# Altium schematic sheet 16路放大模块.SchDoc
size A2 portrait
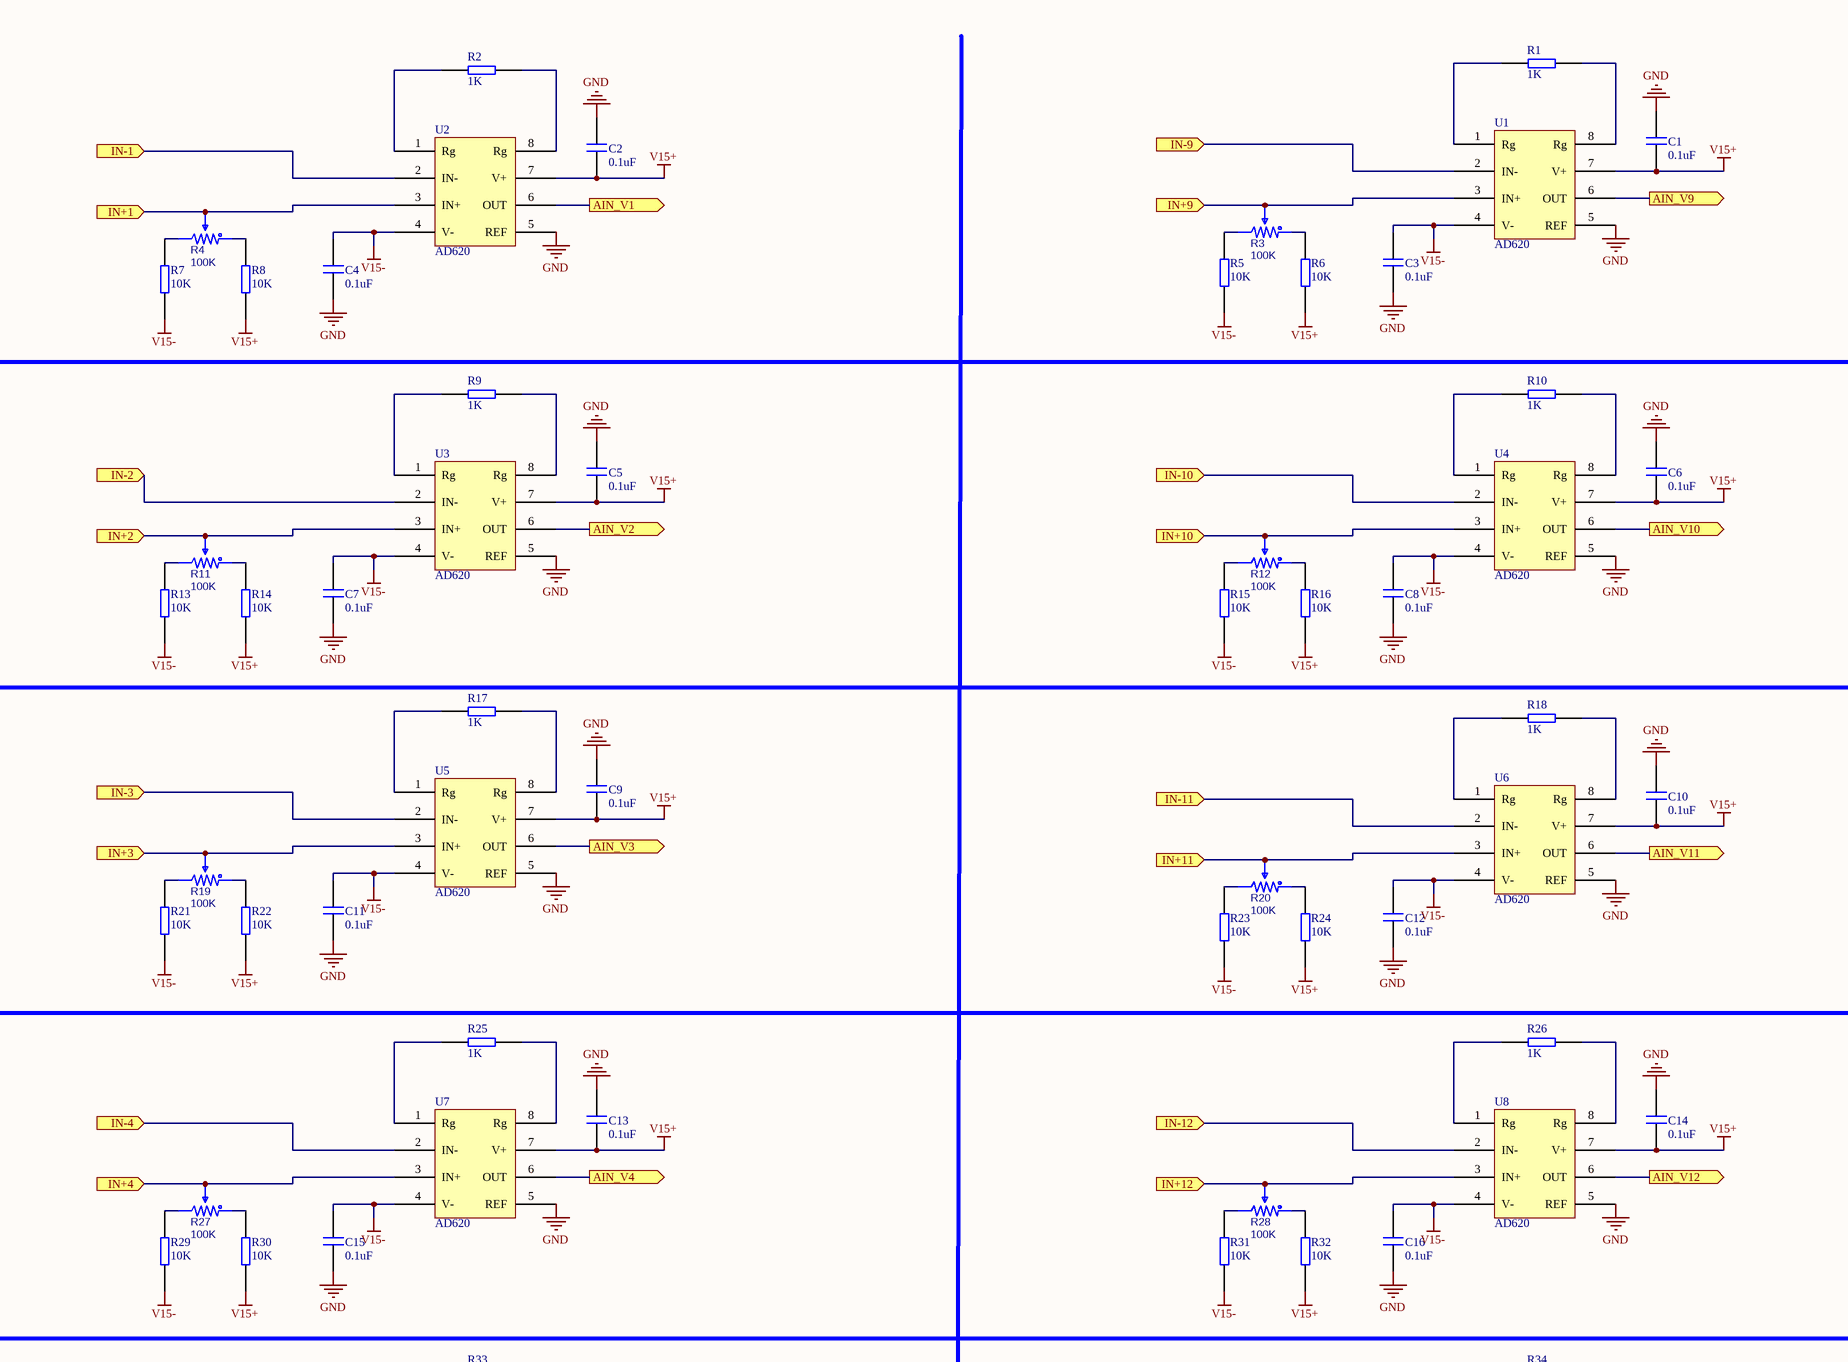
[diagram p0: 16路放大模块.SchDoc, top]
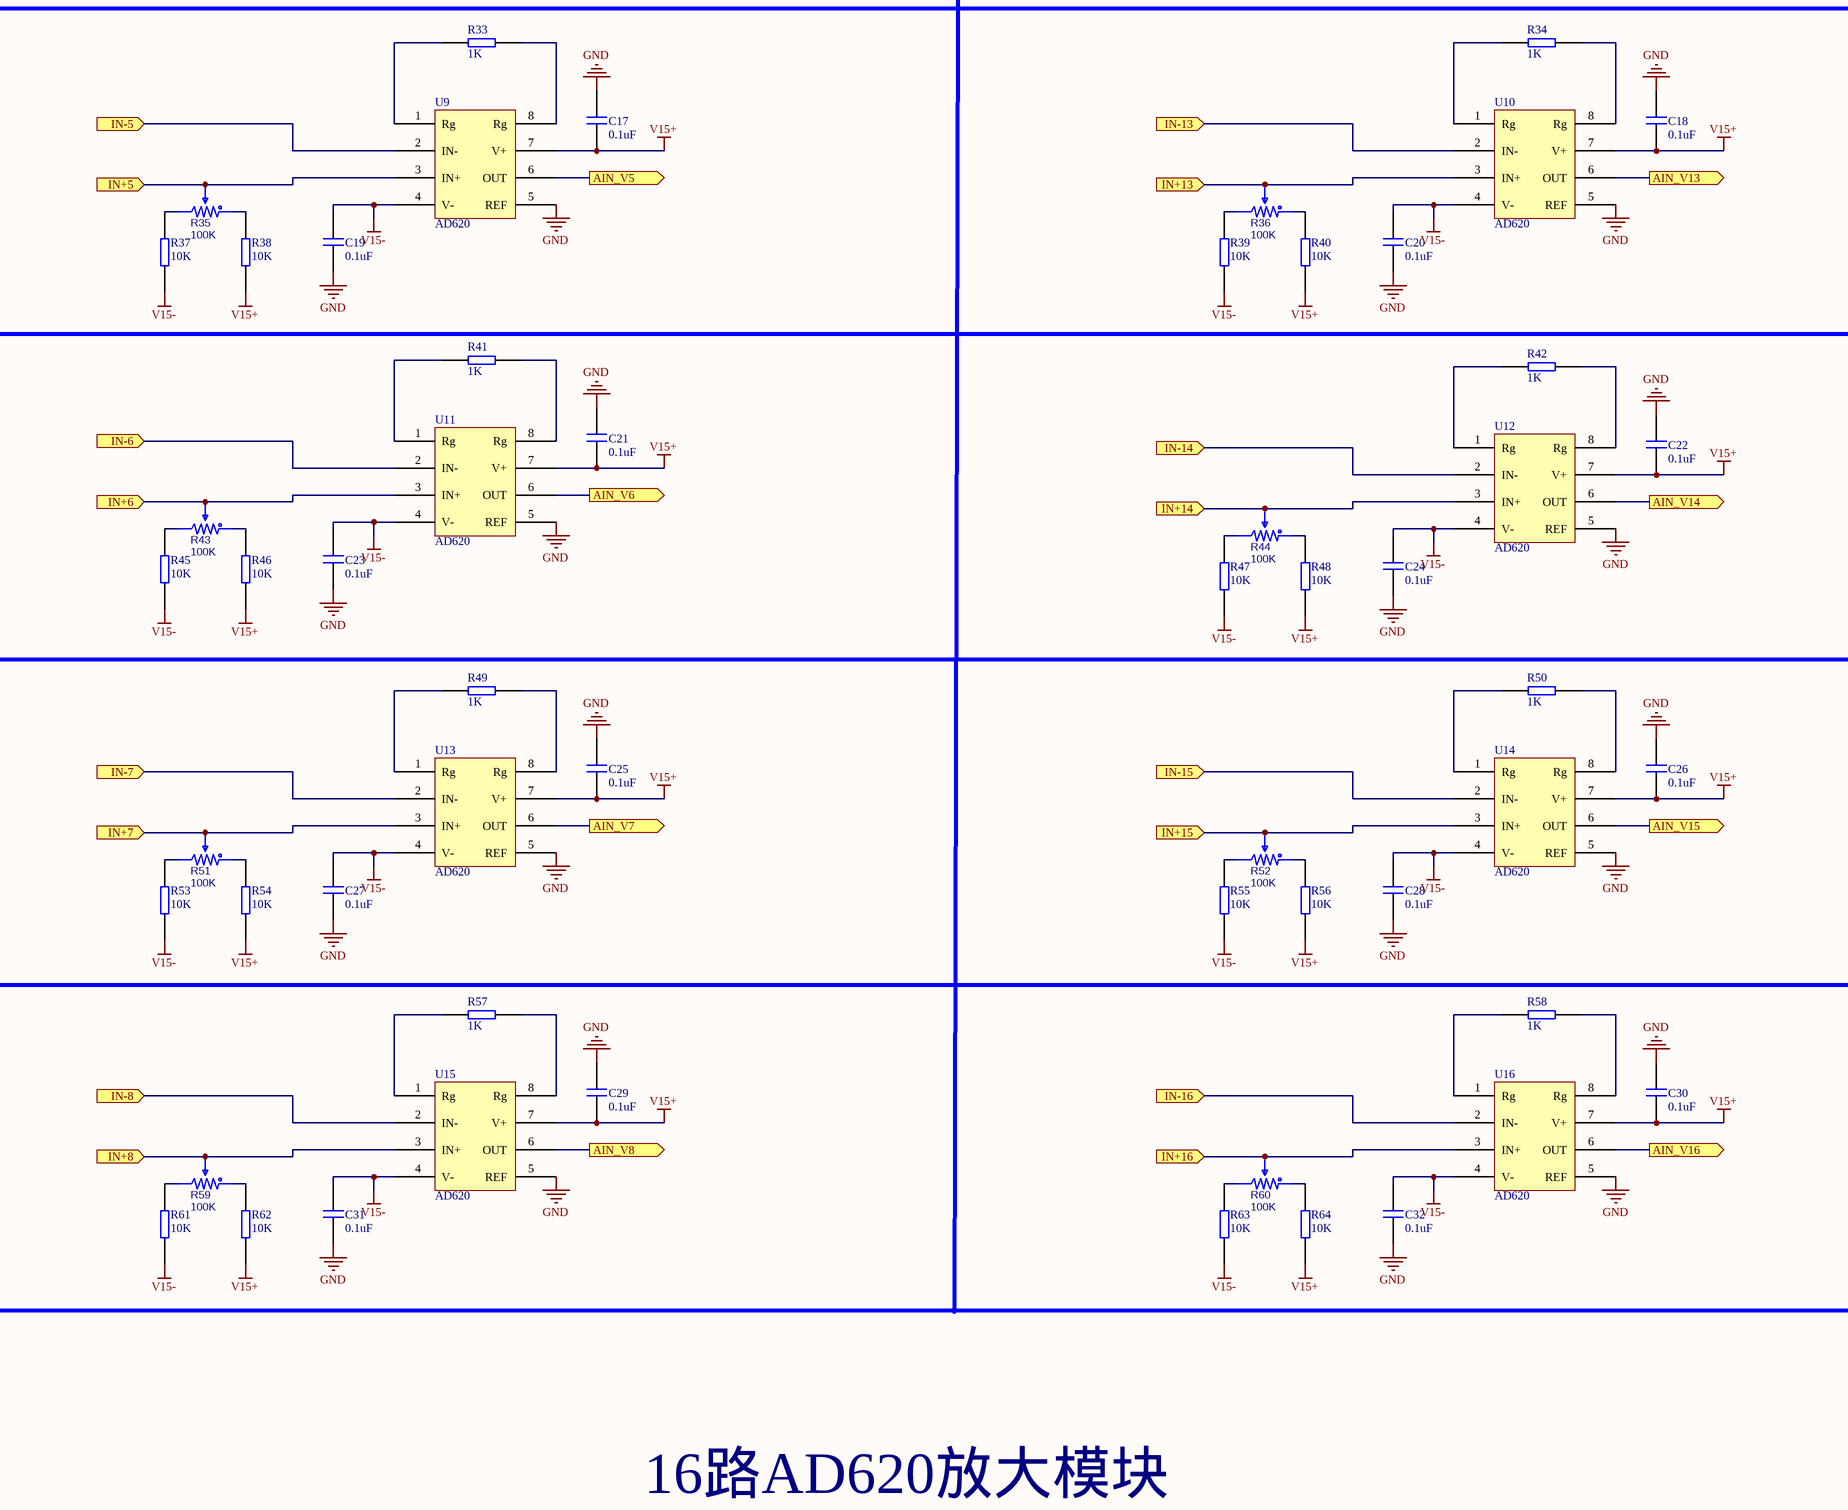
[diagram p1: 16路放大模块.SchDoc, bottom]

## Parts
C1  0.1uF  [0805C]
C2  0.1uF  [0805C]
C3  0.1uF  [0805C]
C4  0.1uF  [0805C]
C5  0.1uF  [0805C]
C6  0.1uF  [0805C]
C7  0.1uF  [0805C]
C8  0.1uF  [0805C]
C9  0.1uF  [0805C]
C10  0.1uF  [0805C]
C11  0.1uF  [0805C]
C12  0.1uF  [0805C]
C13  0.1uF  [0805C]
C14  0.1uF  [0805C]
C15  0.1uF  [0805C]
C16  0.1uF  [0805C]
C17  0.1uF  [0805C]
C18  0.1uF  [0805C]
C19  0.1uF  [0805C]
C20  0.1uF  [0805C]
C21  0.1uF  [0805C]
C22  0.1uF  [0805C]
C23  0.1uF  [0805C]
C24  0.1uF  [0805C]
C25  0.1uF  [0805C]
C26  0.1uF  [0805C]
C27  0.1uF  [0805C]
C28  0.1uF  [0805C]
C29  0.1uF  [0805C]
C30  0.1uF  [0805C]
C31  0.1uF  [0805C]
C32  0.1uF  [0805C]
R1  1K  [0805R]
R2  1K  [0805R]
R3  100K  [RES-ADJ-SMD_G43BT]
R4  100K  [RES-ADJ-SMD_G43BT]
R5  10K  [0603R]
R6  10K  [0603R]
R7  10K  [0603R]
R8  10K  [0603R]
R9  1K  [0805R]
R10  1K  [0805R]
R11  100K  [RES-ADJ-SMD_G43BT]
R12  100K  [RES-ADJ-SMD_G43BT]
R13  10K  [0603R]
R14  10K  [0603R]
R15  10K  [0603R]
R16  10K  [0603R]
R17  1K  [0805R]
R18  1K  [0805R]
R19  100K  [RES-ADJ-SMD_G43BT]
R20  100K  [RES-ADJ-SMD_G43BT]
R21  10K  [0603R]
R22  10K  [0603R]
R23  10K  [0603R]
R24  10K  [0603R]
R25  1K  [0805R]
R26  1K  [0805R]
R27  100K  [RES-ADJ-SMD_G43BT]
R28  100K  [RES-ADJ-SMD_G43BT]
R29  10K  [0603R]
R30  10K  [0603R]
R31  10K  [0603R]
R32  10K  [0603R]
R33  1K  [0805R]
R34  1K  [0805R]
R35  100K  [RES-ADJ-SMD_G43BT]
R36  100K  [RES-ADJ-SMD_G43BT]
R37  10K  [0603R]
R38  10K  [0603R]
R39  10K  [0603R]
R40  10K  [0603R]
R41  1K  [0805R]
R42  1K  [0805R]
R43  100K  [RES-ADJ-SMD_G43BT]
R44  100K  [RES-ADJ-SMD_G43BT]
R45  10K  [0603R]
R46  10K  [0603R]
R47  10K  [0603R]
R48  10K  [0603R]
R49  1K  [0805R]
R50  1K  [0805R]
R51  100K  [RES-ADJ-SMD_G43BT]
R52  100K  [RES-ADJ-SMD_G43BT]
R53  10K  [0603R]
R54  10K  [0603R]
R55  10K  [0603R]
R56  10K  [0603R]
R57  1K  [0805R]
R58  1K  [0805R]
R59  100K  [RES-ADJ-SMD_G43BT]
R60  100K  [RES-ADJ-SMD_G43BT]
R61  10K  [0603R]
R62  10K  [0603R]
R63  10K  [0603R]
R64  10K  [0603R]
U1  AD620  [SOIC127P600X175-8N]
U2  AD620  [SOIC127P600X175-8N]
U3  AD620  [SOIC127P600X175-8N]
U4  AD620  [SOIC127P600X175-8N]
U5  AD620  [SOIC127P600X175-8N]
U6  AD620  [SOIC127P600X175-8N]
U7  AD620  [SOIC127P600X175-8N]
U8  AD620  [SOIC127P600X175-8N]
U9  AD620  [SOIC127P600X175-8N]
U10  AD620  [SOIC127P600X175-8N]
U11  AD620  [SOIC127P600X175-8N]
U12  AD620  [SOIC127P600X175-8N]
U13  AD620  [SOIC127P600X175-8N]
U14  AD620  [SOIC127P600X175-8N]
U15  AD620  [SOIC127P600X175-8N]
U16  AD620  [SOIC127P600X175-8N]

## Ports
AIN_V1 (out), AIN_V2 (out), AIN_V3 (out), AIN_V4 (out), AIN_V5 (out), AIN_V6 (out), AIN_V7 (out), AIN_V8 (out), AIN_V9 (out), AIN_V10 (out), AIN_V11 (out), AIN_V12 (out), AIN_V13 (out), AIN_V14 (out), AIN_V15 (out), AIN_V16 (out), IN+1 (in), IN+2 (in), IN+3 (in), IN+4 (in), IN+5 (in), IN+6 (in), IN+7 (in), IN+8 (in), IN+9 (in), IN+10 (in), IN+11 (in), IN+12 (in), IN+13 (in), IN+14 (in), IN+15 (in), IN+16 (in), IN-1 (in), IN-2 (in), IN-3 (in), IN-4 (in), IN-5 (in), IN-6 (in), IN-7 (in), IN-8 (in), IN-9 (in), IN-10 (in), IN-11 (in), IN-12 (in), IN-13 (in), IN-14 (in), IN-15 (in), IN-16 (in)

## Nets
GND: C1.2 C2.2 C3.1 C4.1 C5.2 C6.2 C7.1 C8.1 C9.2 C10.2 C11.1 C12.1 C13.2 C14.2 C15.1 C16.1 C17.2 C18.2 C19.1 C20.1 C21.2 C22.2 C23.1 C24.1 C25.2 C26.2 C27.1 C28.1 C29.2 C30.2 C31.1 C32.1 U1.5(REF) U2.5(REF) U3.5(REF) U4.5(REF) U5.5(REF) U6.5(REF) U7.5(REF) U8.5(REF) U9.5(REF) U10.5(REF) U11.5(REF) U12.5(REF) U13.5(REF) U14.5(REF) U15.5(REF) U16.5(REF)
V15+: C1.1 C2.1 C5.1 C6.1 C9.1 C10.1 C13.1 C14.1 C17.1 C18.1 C21.1 C22.1 C25.1 C26.1 C29.1 C30.1 R6.1 R8.1 R14.1 R16.1 R22.1 R24.1 R30.1 R32.1 R38.1 R40.1 R46.1 R48.1 R54.1 R56.1 R62.1 R64.1 U1.7(V+) U2.7(V+) U3.7(V+) U4.7(V+) U5.7(V+) U6.7(V+) U7.7(V+) U8.7(V+) U9.7(V+) U10.7(V+) U11.7(V+) U12.7(V+) U13.7(V+) U14.7(V+) U15.7(V+) U16.7(V+)
V15-: C3.2 C4.2 C7.2 C8.2 C11.2 C12.2 C15.2 C16.2 C19.2 C20.2 C23.2 C24.2 C27.2 C28.2 C31.2 C32.2 R5.1 R7.1 R13.1 R15.1 R21.1 R23.1 R29.1 R31.1 R37.1 R39.1 R45.1 R47.1 R53.1 R55.1 R61.1 R63.1 U1.4(V-) U2.4(V-) U3.4(V-) U4.4(V-) U5.4(V-) U6.4(V-) U7.4(V-) U8.4(V-) U9.4(V-) U10.4(V-) U11.4(V-) U12.4(V-) U13.4(V-) U14.4(V-) U15.4(V-) U16.4(V-)
AIN_V1: U2.6(OUT) ; port AIN_V1
AIN_V2: U3.6(OUT) ; port AIN_V2
AIN_V3: U5.6(OUT) ; port AIN_V3
AIN_V4: U7.6(OUT) ; port AIN_V4
AIN_V5: U9.6(OUT) ; port AIN_V5
AIN_V6: U11.6(OUT) ; port AIN_V6
AIN_V7: U13.6(OUT) ; port AIN_V7
AIN_V8: U15.6(OUT) ; port AIN_V8
AIN_V9: U1.6(OUT) ; port AIN_V9
AIN_V10: U4.6(OUT) ; port AIN_V10
AIN_V11: U6.6(OUT) ; port AIN_V11
AIN_V12: U8.6(OUT) ; port AIN_V12
AIN_V13: U10.6(OUT) ; port AIN_V13
AIN_V14: U12.6(OUT) ; port AIN_V14
AIN_V15: U14.6(OUT) ; port AIN_V15
AIN_V16: U16.6(OUT) ; port AIN_V16
IN+1: R4.2 U2.3(IN+) ; port IN+1
IN+2: R11.2 U3.3(IN+) ; port IN+2
IN+3: R19.2 U5.3(IN+) ; port IN+3
IN+4: R27.2 U7.3(IN+) ; port IN+4
IN+5: R35.2 U9.3(IN+) ; port IN+5
IN+6: R43.2 U11.3(IN+) ; port IN+6
IN+7: R51.2 U13.3(IN+) ; port IN+7
IN+8: R59.2 U15.3(IN+) ; port IN+8
IN+9: R3.2 U1.3(IN+) ; port IN+9
IN+10: R12.2 U4.3(IN+) ; port IN+10
IN+11: R20.2 U6.3(IN+) ; port IN+11
IN+12: R28.2 U8.3(IN+) ; port IN+12
IN+13: R36.2 U10.3(IN+) ; port IN+13
IN+14: R44.2 U12.3(IN+) ; port IN+14
IN+15: R52.2 U14.3(IN+) ; port IN+15
IN+16: R60.2 U16.3(IN+) ; port IN+16
IN-1: U2.2(IN-) ; port IN-1
IN-2: U3.2(IN-) ; port IN-2
IN-3: U5.2(IN-) ; port IN-3
IN-4: U7.2(IN-) ; port IN-4
IN-5: U9.2(IN-) ; port IN-5
IN-6: U11.2(IN-) ; port IN-6
IN-7: U13.2(IN-) ; port IN-7
IN-8: U15.2(IN-) ; port IN-8
IN-9: U1.2(IN-) ; port IN-9
IN-10: U4.2(IN-) ; port IN-10
IN-11: U6.2(IN-) ; port IN-11
IN-12: U8.2(IN-) ; port IN-12
IN-13: U10.2(IN-) ; port IN-13
IN-14: U12.2(IN-) ; port IN-14
IN-15: U14.2(IN-) ; port IN-15
IN-16: U16.2(IN-) ; port IN-16
NetR1_1: R1.1 U1.1(Rg)
NetR1_2: R1.2 U1.8(Rg)
NetR2_1: R2.1 U2.1(Rg)
NetR2_2: R2.2 U2.8(Rg)
NetR3_1: R3.1 R6.2
NetR3_3: R3.3 R5.2
NetR4_1: R4.1 R8.2
NetR4_3: R4.3 R7.2
NetR9_1: R9.1 U3.1(Rg)
NetR9_2: R9.2 U3.8(Rg)
NetR10_1: R10.1 U4.1(Rg)
NetR10_2: R10.2 U4.8(Rg)
NetR11_1: R11.1 R14.2
NetR11_3: R11.3 R13.2
NetR12_1: R12.1 R16.2
NetR12_3: R12.3 R15.2
NetR17_1: R17.1 U5.1(Rg)
NetR17_2: R17.2 U5.8(Rg)
NetR18_1: R18.1 U6.1(Rg)
NetR18_2: R18.2 U6.8(Rg)
NetR19_1: R19.1 R22.2
NetR19_3: R19.3 R21.2
NetR20_1: R20.1 R24.2
NetR20_3: R20.3 R23.2
NetR25_1: R25.1 U7.1(Rg)
NetR25_2: R25.2 U7.8(Rg)
NetR26_1: R26.1 U8.1(Rg)
NetR26_2: R26.2 U8.8(Rg)
NetR27_1: R27.1 R30.2
NetR27_3: R27.3 R29.2
NetR28_1: R28.1 R32.2
NetR28_3: R28.3 R31.2
NetR33_1: R33.1 U9.1(Rg)
NetR33_2: R33.2 U9.8(Rg)
NetR34_1: R34.1 U10.1(Rg)
NetR34_2: R34.2 U10.8(Rg)
NetR35_1: R35.1 R38.2
NetR35_3: R35.3 R37.2
NetR36_1: R36.1 R40.2
NetR36_3: R36.3 R39.2
NetR41_1: R41.1 U11.1(Rg)
NetR41_2: R41.2 U11.8(Rg)
NetR42_1: R42.1 U12.1(Rg)
NetR42_2: R42.2 U12.8(Rg)
NetR43_1: R43.1 R46.2
NetR43_3: R43.3 R45.2
NetR44_1: R44.1 R48.2
NetR44_3: R44.3 R47.2
NetR49_1: R49.1 U13.1(Rg)
NetR49_2: R49.2 U13.8(Rg)
NetR50_1: R50.1 U14.1(Rg)
NetR50_2: R50.2 U14.8(Rg)
NetR51_1: R51.1 R54.2
NetR51_3: R51.3 R53.2
NetR52_1: R52.1 R56.2
NetR52_3: R52.3 R55.2
NetR57_1: R57.1 U15.1(Rg)
NetR57_2: R57.2 U15.8(Rg)
NetR58_1: R58.1 U16.1(Rg)
NetR58_2: R58.2 U16.8(Rg)
NetR59_1: R59.1 R62.2
NetR59_3: R59.3 R61.2
NetR60_1: R60.1 R64.2
NetR60_3: R60.3 R63.2

## Notes on the sheet
- 16路AD620放大模块
- Title
- Size:
- Date:
- File:
- A2
- Number:
- Time:
- Revision:
- Sheet
- of

## Library data of the parts
C1-C32 = CAP: 普通电容
R1 R2 R5-R10 R13-R18 R21-R26 R29-R34 R37-R42 R45-R50 R53-R58 R61-R64 = RES: 电阻模型
R3 R4 R11 R12 R19 R20 R27 R28 R35 R36 R43 R44 R51 R52 R59 R60 = 100K: 电位器; BOM_Manufacturer: Chengdu Guosheng Tech; BOM_Manufacturer Part: 3323P-1-104; nameAlias: Resistance (Ohms); Contributor: LCSC; BOM_Supplier: LCSC; BOM_Supplier Part: C125003; Resistance(Ohms): 100K; BOM_JLCPCB Part Class: Extended Part; spicePre: R; spiceSymbolName: 3323P-1-104
U1-U16 = AD620: 仪表放大芯片